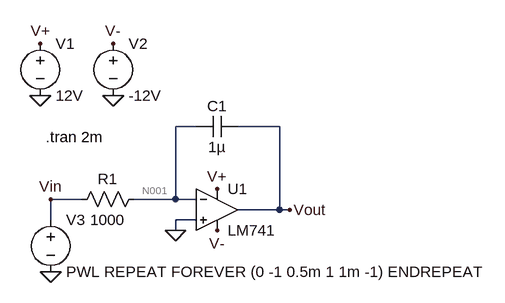
[diagram p0: schematic integrator.asc]
integrator.asc, the LTspice schematic file:
Version 4
SHEET 1 880 680
WIRE 400 32 368 32
WIRE 528 32 464 32
WIRE 224 144 176 144
WIRE 368 144 368 32
WIRE 368 144 304 144
WIRE 400 144 368 144
WIRE 528 160 528 32
WIRE 528 160 464 160
WIRE 544 160 528 160
WIRE 176 176 176 144
WIRE 400 176 368 176
WIRE 368 192 368 176
FLAG 368 192 0
FLAG 160 -16 0
FLAG 272 -16 0
FLAG 176 256 0
FLAG 160 -96 V+
FLAG 432 128 V+
FLAG 272 -96 V-
FLAG 432 192 V-
FLAG 544 160 Vout
FLAG 176 144 Vin
SYMBOL res 320 128 R90
WINDOW 0 0 56 VBottom 2
WINDOW 3 32 56 VTop 2
SYMATTR InstName R1
SYMATTR Value 1000
SYMBOL cap 464 16 R90
WINDOW 0 0 32 VBottom 2
WINDOW 3 32 32 VTop 2
SYMATTR InstName C1
SYMATTR Value 1µ
SYMBOL Opamps\\LM741 432 96 R0
SYMATTR InstName U1
SYMBOL voltage 160 -112 R0
WINDOW 123 0 0 Left 0
WINDOW 39 0 0 Left 0
SYMATTR InstName V1
SYMATTR Value 12V
SYMBOL voltage 272 -112 R0
WINDOW 123 0 0 Left 0
WINDOW 39 0 0 Left 0
SYMATTR InstName V2
SYMATTR Value -12V
SYMBOL voltage 176 160 R0
WINDOW 123 0 0 Left 0
WINDOW 39 0 0 Left 0
SYMATTR InstName V3
SYMATTR Value PWL REPEAT FOREVER (0 -1 0.5m 1 1m -1) ENDREPEAT
TEXT 168 48 Left 2 !.tran 2m

The netlist it stands for:
* integrator.asc
R1 N001 Vin 1000
C1 Vout N001 1µ
XU1 0 N001 V+ V- Vout LM741  ; pins In+ In- V+ V- OUT
V1 V+ 0 12V
V2 V- 0 -12V
V3 Vin 0 PWL REPEAT FOREVER (0 -1 0.5m 1 1m -1) ENDREPEAT
.tran 2m
.lib LM741.lib
.backanno
.end

* Results of the author's LTspice run, read from the files saved beside the schematic
* Operating Point, zero values left out:
*   V(n001) = -998 mV
*   V(vin) = -1 V
*   V(vout) = 11.03 V
*   V(v-) = -12 V
*   V(v+) = 12 V
*   I(R1) = 1.976 µA
*   I(V3) = 1.976 µA
*   I(V2) = 1.626 mA
*   I(V1) = -1.626 mA
*   Ix(u1:1) = 2.136 µA
*   Ix(u1:2) = -1.976 µA
*   Ix(u1:99) = 1.626 mA
*   Ix(u1:50) = -1.626 mA
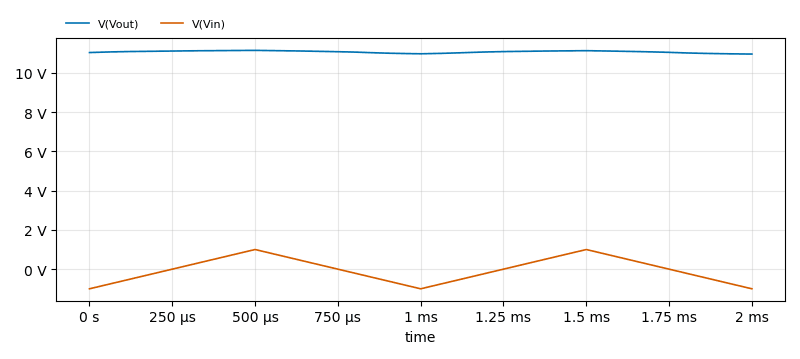
[diagram p1: Transient Analysis of integrator.asc, plotted from the saved traces]
* Transient Analysis, 1 run:
*   V(Vout): min 10.95 V, max 11.14 V, average 11.06 V, rms 11.06 V, last 10.95 V
*   V(Vin): min -1 V, max 1 V, average -35.85 µV, rms 606.9 mV, last -1 V